# Altium schematic sheet 14.FAN_RTC_BAT.SchDoc: CM3 IO
size 297 x 209 mm; Page Create Date: March  8, 1995; Page Number: 14; Page Size: A4; Comment: radxa_1010; Page Count: 20; RevCode: 1.36; Doc: FAN_RTC_BAT; DsnPath: D:\WMS\黄工\[RC119]CM3_IO_V1.36\对外资料\radxa_cm3_io_board_v1360.DSN; SchematicName: CM3_IO V1.36; PageName: 14.FAN_RTC_BAT; PageSize: A4; TopSchematic: True
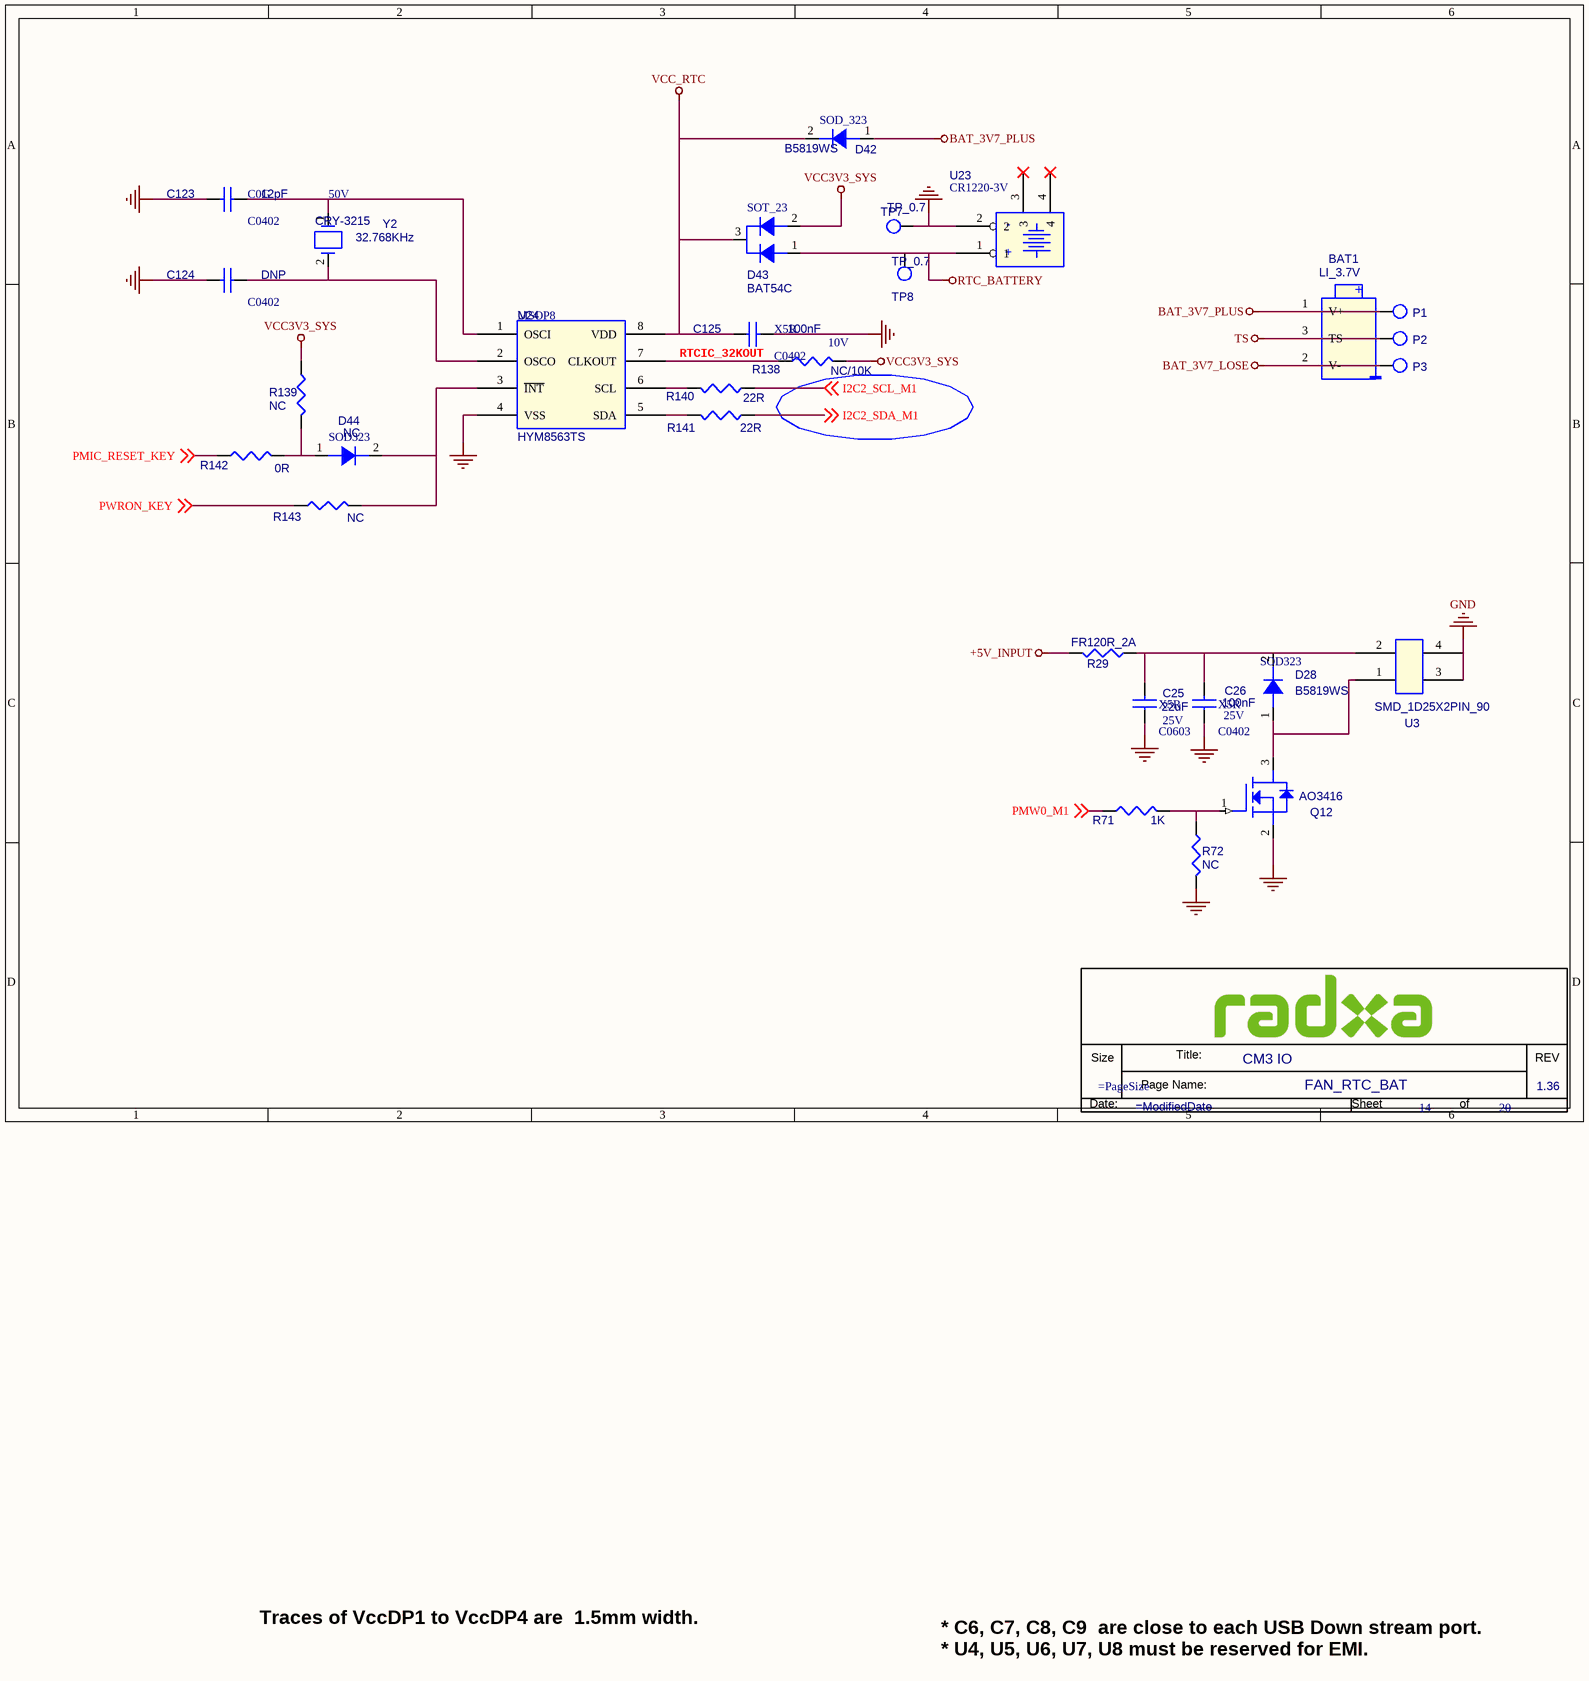
[diagram p0: 14.FAN_RTC_BAT.SchDoc]

## Parts
*  Doc: FAN_RTC_BAT  RevCode: 1.36  Title: CM3 IO  Page Number: 14  Page Count: 20  (hidden comment: radxa_1010)  (graphical)
BAT1  LI_3.7V  [SMD-3P-1.25]
C25  22uF  Voltage: 25V  Dielectric: X5R  [C0603]
C26  100nF  Voltage: 25V  Dielectric: X5R  [C0402]
C123  12pF  Voltage: 50V  Dielectric: C0G  [C0402]
C124  DNP  [C0402]
C125  100nF  Voltage: 10V  Dielectric: X5R  [C0402]
D28  B5819WS  [SOD323]
D42  B5819WS  [SOD_323]
D43  BAT54C  [SOT_23]
D44  NC  [SOD323]
P1  TEST  [TEST]  (value not drawn)
P2  TEST  [TEST]  (value not drawn)
P3  TEST  [TEST]  (value not drawn)
Q12  AO3416  [SOT23]
R29  FR120R_2A  [R0402]
R71  1K  [R0201]
R72  NC  [R0402]
R138  NC/10K  [R0402]
R139  NC  [R0402]
R140  22R  [R0402]
R141  22R  [R0402]
R142  0R  [R0402]
R143  NC  [R0402]
TP7  TP_0.7  [TEST]
TP8  TP_0.7  [TEST]
U3  SMD_1D25X2PIN_90  [SMD_1D25X2PIN_90]
U23  CR1220-3V  [BATTERY-20MM]
U24  HYM8563TS  [MSOP8]
Y2  32.768KHz  [CRY-3215]

## Nets
+5V_INPUT: R29.1
BAT_3V7_LOSE: BAT1.2(V-) P3.1
BAT_3V7_PLUS: BAT1.1(V+) D42.1(A) P1.1
GND: C25.1 C26.1 C123.2 C124.2 C125.2 Q12.2(SOURCE) R72.2 TP7.1 U3.3 U3.4 U23.2 U24.4(VSS)
RTC_BATTERY: D43.1(A1) TP8.1 U23.1
TS: BAT1.3(TS) P2.1
VCC3V3_SYS: D43.2(A2) R138.2 R139.1
VCC_RTC: C125.1 D42.2(K) D43.3(K) U24.8(VDD)
I2C2_SCL_M1: R140.1 ; off-sheet I2C2_SCL_M1
I2C2_SDA_M1: R141.1 ; off-sheet I2C2_SDA_M1
PMIC_RESET_KEY: R142.1 ; off-sheet PMIC_RESET_KEY
PMW0_M1: R71.1 ; off-sheet PMW0_M1
PWRON_KEY: R143.1 ; off-sheet PWRON_KEY
RTCIC_32KOUT: R138.1 U24.7(CLKOUT)
NetC25_2: C25.2 C26.2 D28.2(K) R29.2 U3.2
NetC123_1: C123.1 U24.1(OSCI) Y2.1
NetC124_1: C124.1 U24.2(OSCO) Y2.2
NetD28_1: D28.1(A) Q12.3(DRAIN) U3.1
NetD44_1: D44.1(A) R139.2 R142.2
NetD44_2: D44.2(K) R143.2 U24.3(~{INT})
NetQ12_1: Q12.1(GATE) R71.2 R72.1
NetR140_2: R140.2 U24.6(SCL)
NetR141_2: R141.2 U24.5(SDA)

Not connected (* = marked no-connect by the designer): U23 3* 4*

## Notes on the sheet
- * C6, C7, C8, C9  are close to each USB Down stream port.
  * U4, U5, U6, U7, U8 must be reserved for EMI.
- Traces of VccDP1 to VccDP4 are  1.5mm width.
- (in symbol BATTERY_1) +; -
- (in symbol CON_BATTERY-20MM_0) -; +
- (in symbol radxa_1010) Title:; Size; REV; Page Name:; Date:; Sheet; of

## Library data of the parts
BAT1 = BATTERY_1: Part Reference: BAT1; Value: LI_3.7V; PCB Footprint: SMD-3P-1.25
C25 = CAP NP_0: cap,22.00uF,+/-10%,10V,X5R,C0805; Part Reference: C25; Manufacturer PN: C2012X5R1A226K125AB; Manufacturer: TDK; Tolerance: 10%; Priority: A; PCB Footprint: C0603; Value: 22uF; Created by: JJJ; Part Type: C0805; RK PN: C2012X5R1A226K125AB
C26 = CAP NP_0: cap,100.00nF,+/-10%,16V,X5R,C0402; Part Reference: C26; Manufacturer: TDK; RK PN: C1005X5R1C104K050BA; Priority: A; Tolerance: 10%; PCB Footprint: C0402; Value: 100nF; Part Type: C0402; Manufacturer PN: C1005X5R1C104K050BA; Created by: JJJ
C123 = CAP NP_0: cap,12.00pF,+/-5%,50V,C0G,C0402; Part Reference: C123; Manufacturer: TDK; RK PN: C1005C0G1H120J050BA; Priority: A; Tolerance: 5%; PCB Footprint: C0402; Value: 12pF; Part Type: C0402; Manufacturer PN: C1005C0G1H120J050BA; Created by: JJJ
C124 = CAP NP_0: Did Not Place.; Part Reference: C124; Manufacturer PN: DNPC0402; Priority: A; PCB Footprint: C0402; Value: DNP; Created by: JJJ; Part Type: DNP; RK PN: DNPC0402
C125 = CAP NP_0: cap,100.00nF,+/-10%,10V,X5R,C0402; Part Reference: C125; Manufacturer: TDK; Number: 37; RK PN: C1005X5R1A104K050BA; Priority: A; Tolerance: 10%; C_Voltage: 6.3V; PCB Footprint: C0402; Value: 100nF; Part Type: C0402; Manufacturer PN: C1005X5R1A104K050BA; Created by: JJJ
D28 = DIODE: Schottky Barrier，B5819W SOD-123; Part Reference: D28; Manufacturer: 长电; RK PN: B5819W; Priority: A; PCB Footprint: SOD323; Value: B5819WS; Part Type: Schottky rectifier; Manufacturer PN: B5819W; Created by: JJJ
D42 = DIODE: Schottky Barrier，B5819WS SOD-323; Part Reference: D42; Manufacturer: 长电; Priority: A; PCB Footprint: SOD_323; Value: B5819WS; Created by: JJJ; Manufacturer PN: B5819WS; Part Type: Schottky rectifier; RK PN: B5819WS
D43 = DIODE Double: Dual Schottky barrier，BAT54C SOT-23 Schottky Barrier; Part Reference: D43; Manufacturer: 长电; Priority: A; PCB Footprint: SOT_23; Value: BAT54C; Created by: JJJ; Manufacturer PN: BAT54C; Part Type: Schottky rectifier; RK PN: BAT54C
D44 = DIODE: Schottky Barrier，B5819WS SOD-323; Part Reference: D44; Manufacturer: 长电; Priority: A; PCB Footprint: SOD323; Value: NC; RK PN: B5819WS; Part Type: Schottky rectifier; Manufacturer PN: B5819WS; Created by: JJJ
P1 = TESTPOINT1: Part Reference: P1; PCB Footprint: TP_0R70; Value: TEST
P2 = TESTPOINT1: Part Reference: P2; PCB Footprint: TP_0R70; Value: TEST
P3 = TESTPOINT1: Part Reference: P3; PCB Footprint: TP_0R70; Value: TEST
Q12 = MOSFET N: MOSFET-N,WNM3003 ,30V,+/-20V,4.0A,33m Ohm@Vgs=10V,43m Ohm@Vgs=4.5V,SOT23; Part Reference: Q12; Value: AO3416; PCB Footprint: SOT23
R29 = RESISTOR_0: 通用厚膜电阻,100K,+/-5%,R0402,1/16W.; Part Reference: R29; Manufacturer PN: RC0402JR-07100KL; Manufacturer: YAGEO; Wattage: 1/16W; Tolerance: 5%; Priority: A; Value: FR120R_2A; Created by: YTL; Part Type: R0805; RK PN: RC0402JR-07100KL; PCB Footprint: R0402
R71 = RESISTOR_0: 通用厚膜电阻,100K,+/-5%,R0402,1/16W.; Part Reference: R71; Manufacturer: YAGEO; RK PN: RC0402JR-07100KL; Priority: A; Tolerance: 5%; Wattage: 1/16W; Value: 1K; Part Type: 通用厚膜电阻; Manufacturer PN: RC0402JR-07100KL; Created by: YTL; PCB Footprint: R0201
R72 = RESISTOR_0: 通用厚膜电阻,10K,+/-5%,R0402,1/16W.; Part Reference: R72; Manufacturer: YAGEO; RK PN: RC0402JR-0710KL; Priority: A; Tolerance: 5%; Wattage: 1/16W; Value: NC; Part Type: 通用厚膜电阻; Manufacturer PN: RC0402JR-0710KL; Created by: YTL; PCB Footprint: R0402
R138 = RESISTOR_0: 通用厚膜电阻,10K,+/-5%,R0402,1/16W.; Part Reference: R138; Manufacturer: YAGEO; RK PN: RC0402JR-0710KL; Priority: A; Tolerance: 5%; Wattage: 1/16W; option: DNP; Value: NC/10K; Part Type: 通用厚膜电阻; Manufacturer PN: RC0402JR-0710KL; Created by: YTL; PCB Footprint: R0402
R139 = RESISTOR_0: 通用厚膜电阻,10K,+/-5%,R0402,1/16W.; Part Reference: R139; Manufacturer PN: RC0402JR-0710KL; Manufacturer: YAGEO; option: DNP; Wattage: 1/16W; Tolerance: 5%; Priority: A; Value: NC; Created by: YTL; Part Type: 通用厚膜电阻; RK PN: RC0402JR-0710KL; PCB Footprint: R0402
R140 = RESISTOR_0: 通用厚膜电阻,47K,+/-5%,R0402,1/16W.; Part Reference: R140; Manufacturer PN: RC0402JR-0747KL; Manufacturer: YAGEO; Wattage: 1/16W; Tolerance: 5%; Priority: A; Value: 22R; Created by: YTL; Part Type: 通用厚膜电阻; RK PN: RC0402JR-0747KL; PCB Footprint: R0402
R141 = RESISTOR_0: 通用厚膜电阻,47K,+/-5%,R0402,1/16W.; Part Reference: R141; Manufacturer PN: RC0402JR-0747KL; Manufacturer: YAGEO; Wattage: 1/16W; Tolerance: 5%; Priority: A; Value: 22R; Created by: YTL; Part Type: 通用厚膜电阻; RK PN: RC0402JR-0747KL; PCB Footprint: R0402
R142 = RESISTOR_0: 通用厚膜电阻,10K,+/-5%,R0402,1/16W.; Part Reference: R142; Manufacturer: YAGEO; RK PN: RC0402JR-0710KL; Priority: A; Tolerance: 5%; Wattage: 1/16W; option: DNP; Value: 0R; Part Type: 通用厚膜电阻; Manufacturer PN: RC0402JR-0710KL; Created by: YTL; PCB Footprint: R0402
R143 = RESISTOR_0: 通用厚膜电阻,10K,+/-5%,R0402,1/16W.; Part Reference: R143; Manufacturer PN: RC0402JR-0710KL; Manufacturer: YAGEO; option: DNP; Wattage: 1/16W; Tolerance: 5%; Priority: A; Value: NC; Created by: YTL; Part Type: 通用厚膜电阻; RK PN: RC0402JR-0710KL; PCB Footprint: R0402
TP7 = TP: Test Point 0.7mm; Part Reference: TP7; PCB Footprint: TP_0R70; Priority: A; RK PN: TESTPOINT_0R7; Value: TP_0.7; Created by: JJJ; Part Type: TP
TP8 = TP: Test Point 0.7mm; Part Reference: TP8; PCB Footprint: TP_0R70; Priority: A; RK PN: TESTPOINT_0R7; Value: TP_0.7; Created by: JJJ; Part Type: TP
U3 = CON3_6: Part Reference: U3; Value: SMD_1D25X2PIN_90; PCB Footprint: SMD_1D25X2PIN_90
U23 = CON_BATTERY-20MM_0: Part Reference: U23; PCB Footprint: BAT_CR1220; Value: CR1220-3V
U24 = RTC_HYM8563: I2C Real Time Clock/Calendar; Part Reference: U24; Manufacturer: Haoyu（昊昱微电子）; Priority: A; PCB Footprint: MSOP8; Value: HYM8563TS; RK PN: HYM8563TS; Part Type: RTC; Manufacturer PN: HYM8563TS; Created by: JJJ
Y2 = CRYSTAL_2P_0: 无源晶振，32.768KHz，MC-146,±20ppm，12.5pF，Hosonic; Part Reference: Y2; Manufacturer: Hosonic(鸿星电子); RK PN: ETDE32.768W125BMPF; Priority: A; PCB Footprint: CRY-3215; Value: 32.768KHz; Part Type: CRYSTAL; Manufacturer PN: ETDE32.768W125BMPF; Created by: JJJ
* = radxa_1010: Page Create Date: March  8, 1995; Page Size: =PageSize; Page Modify Date: =ModifiedDate